# EAGLE design pcb_univ_3-6-0-x-rev5 (EAGLE 7.2.0)
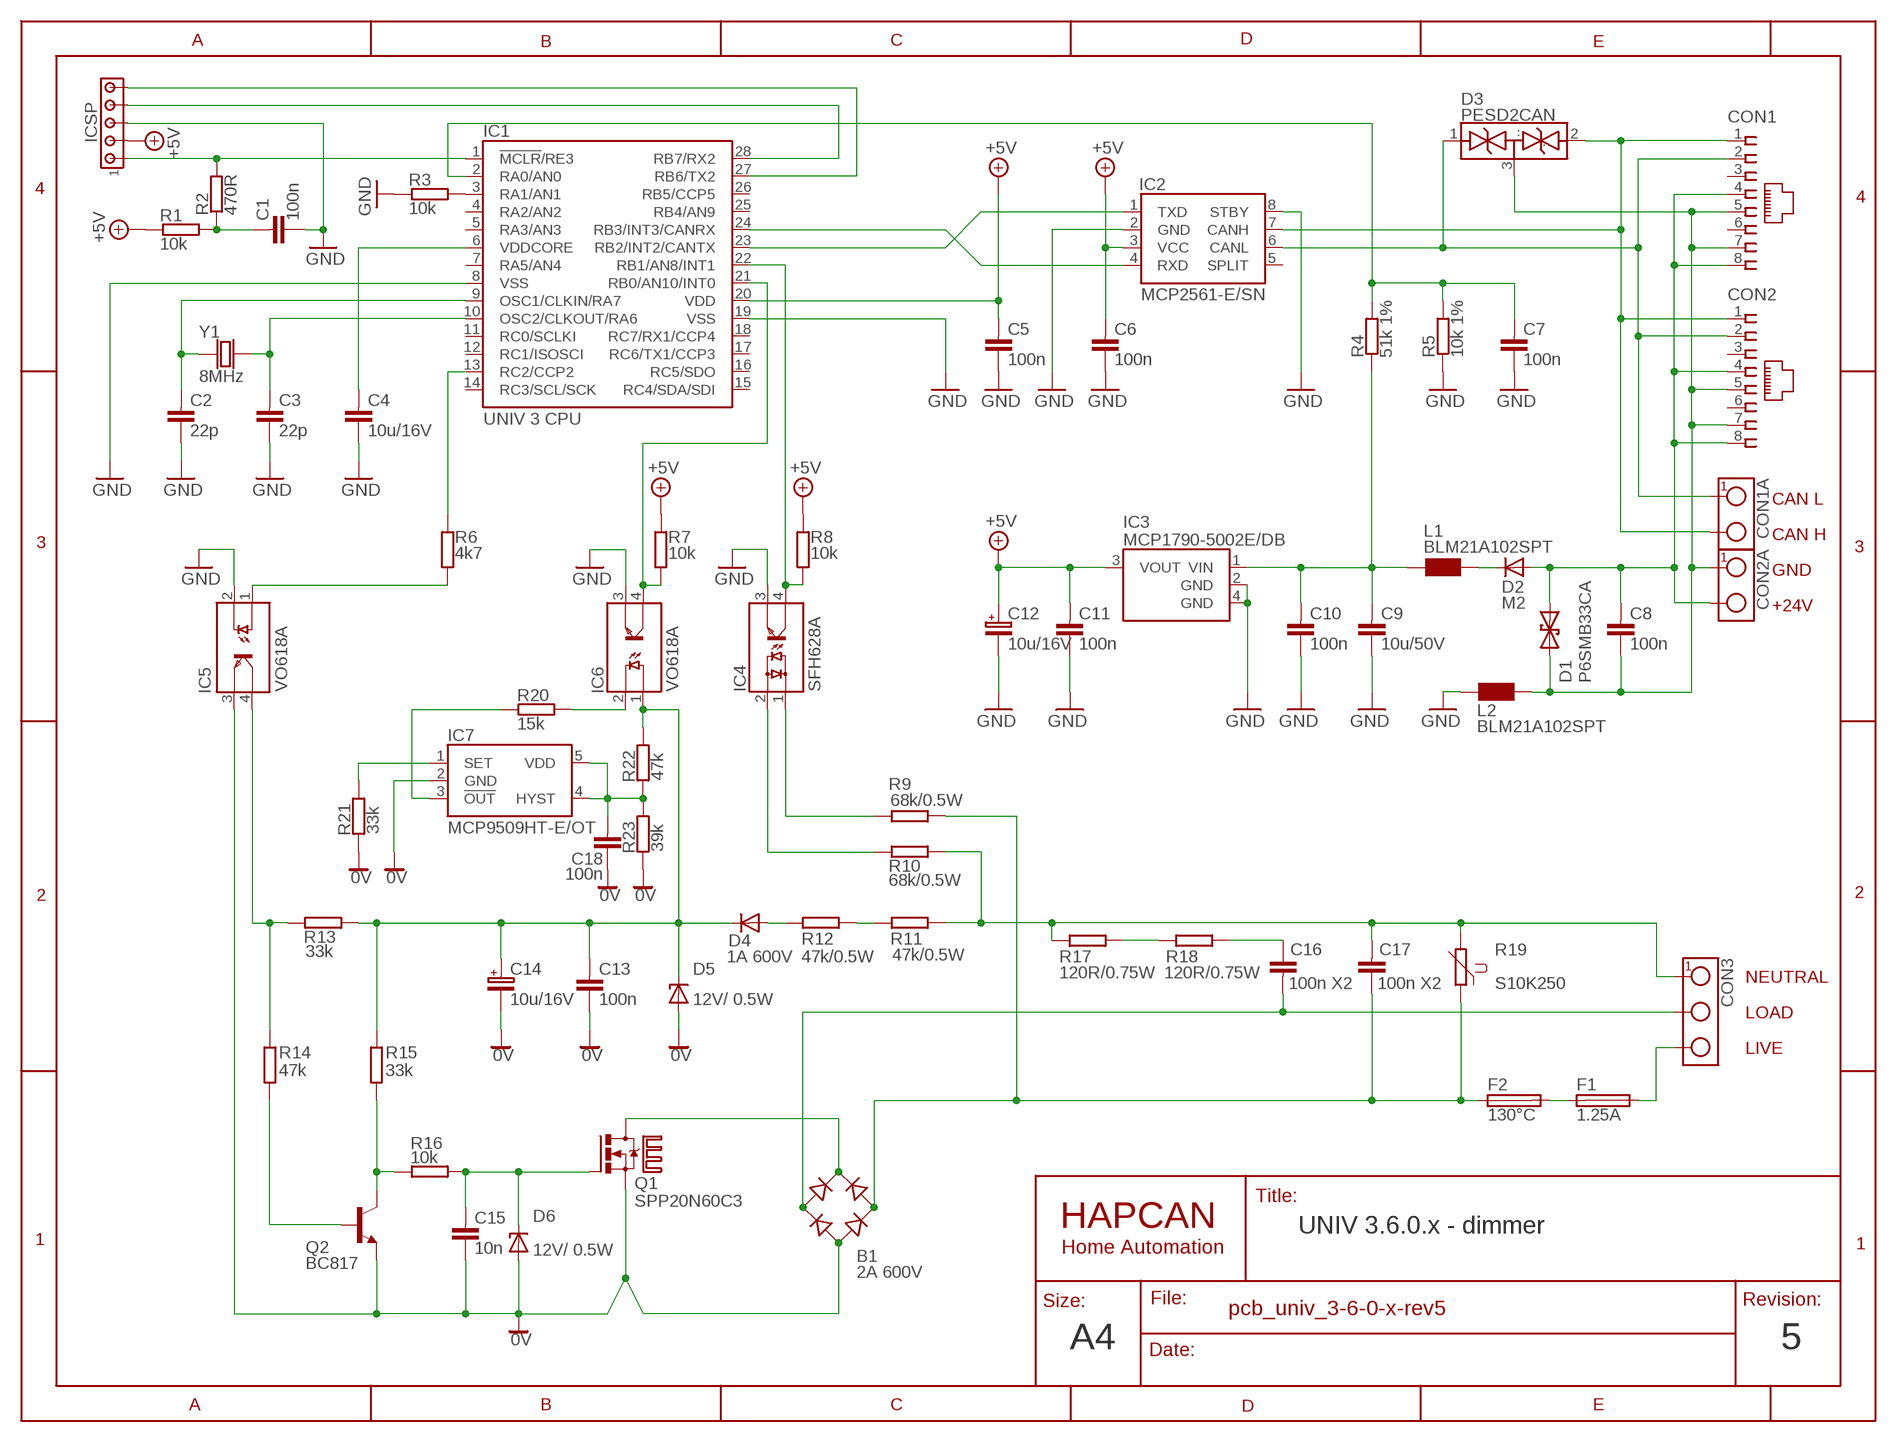
[diagram p0: schematic, sheet 1]

## Parts
B1  2A 600V  DIODE_BRIDGE-5.0  [RECTIFIER_KBP]
C1  100n  CAPACITOR0805  [0805]
C2  22p  CAPACITOR0805  [0805]
C3  22p  CAPACITOR0805  [0805]
C4  10u/16V  CAPACITOR0805  [0805]
C5  100n  CAPACITOR0805  [0805]
C6  100n  CAPACITOR0805  [0805]
C7  100n  CAPACITOR0805  [0805]
C8  100n  CAPACITOR0805  [0805]
C9  10u/50V  CAPACITOR1210  [1210]
C10  100n  CAPACITOR0805  [0805]
C11  100n  CAPACITOR0805  [0805]
C12  10u/16V  CAPACITOR-POLARIZED-SMC_B  [SMC_B]
C13  100n  CAPACITOR0805  [0805]
C14  10u/16V  CAPACITOR-POLARIZED-SMC_B  [SMC_B]
C15  10n  CAPACITOR0805  [0805]
C16  100n X2  CAPACITOR15X5  [CAP-15X5]
C17  100n X2  CAPACITOR15X5  [CAP-15X5]
C18  100n  CAPACITOR0805  [0805]
CON1  RJ45-SOCKET  [RJ45-PCB-SOCKET]
CON1A  TERMINAL-2  TERMINAL-2-5X10,5MM  [ARK2-5X10,5MM]
CON2  RJ45-SOCKET  [RJ45-PCB-SOCKET]
CON2A  TERMINAL-2  TERMINAL-2-5X10,5MM  [ARK2-5X10,5MM]
CON3  TERMINAL-3  TERMINAL-3-5X10.5MM  [ARK3-5X10.5MM]
D1  P6SMB33CA  DIODE_TRANSIL2  [DO-214_TRANSIL2]
D2  M2  DIODE_DO-214  [DO-214]
D3  PESD2CAN  PESD2CANSOT-23  [SOT-23]
D4  1A 600V  DIODE_MELF  [DO-213]
D5  12V/ 0.5W  DIODE_ZENER_SOD-80  [SOD-80]
D6  12V/ 0.5W  DIODE_ZENER_SOD-80  [SOD-80]
F1  1.25A  FUSE_V  [FUSE-HOLDER-V]
F2  130°C  FUSE  [FUSE-7.5]
IC1  UNIV 3 CPU  UNIV3CPU-I/SO  [UNIV3CPU]
IC2  MCP2561-E/SN  [SO-08]
IC3  MCP1790-5002E/DB  MCP1790  [SOT-223]
IC4  SFH628A  COUPLER-1CH-AC_WIDE  [DIL-04W]
IC5  VO618A  COUPLER-1CH_04W  [DIL-04W]
IC6  VO618A  COUPLER-1CH_04W  [DIL-04W]
IC7  MCP9509HT-E/OT  MCP9509  [SOT-23-5]
ICSP  HEADER5  [SIP-5]
L1  BLM21A102SPT  CHOKE0805  [0805]
L2  BLM21A102SPT  CHOKE0805  [0805]
Q1  SPP20N60C3  TRANSISTOR_MOSFET_N_TO220V-3  [TO220V-3]
Q2  BC817  TRANSISTOR_NPN  [SOT-23]
R1  10k  RESISTOR0805  [0805]
R2  470R  RESISTOR0805  [0805]
R3  10k  RESISTOR0805  [0805]
R4  51k 1%  RESISTOR0805  [0805]
R5  10k 1%  RESISTOR0805  [0805]
R6  4k7  RESISTOR0805  [0805]
R7  10k  RESISTOR0805  [0805]
R8  10k  RESISTOR0805  [0805]
R9  68k/0.5W  RESISTOR2010  [2010]
R10  68k/0.5W  RESISTOR2010  [2010]
R11  47k/0.5W  RESISTOR2010  [2010]
R12  47k/0.5W  RESISTOR2010  [2010]
R13  33k  RESISTOR0805  [0805]
R14  47k  RESISTOR0805  [0805]
R15  33k  RESISTOR0805  [0805]
R16  10k  RESISTOR0805  [0805]
R17  120R/0.75W  RESISTOR2010  [2010]
R18  120R/0.75W  RESISTOR2010  [2010]
R19  S10K250  VARISTOR7.5MM-2  [VARISTOR3]
R20  15k  RESISTOR0805  [0805]
R21  33k  RESISTOR0805  [0805]
R22  47k  RESISTOR0805  [0805]
R23  39k  RESISTOR0805  [0805]
U$1  HEATSINK_HS003  [HEATSINK_HS-003]
Y1  8MHz  CRYSTAL-HC49V  [CRYSTAL-HC49V]

## Nets
0V: B1.- C13.2 C14.- C15.2 C18.2 D5.A D6.A IC5.3(E) IC7.2(GND) Q1.3(S) Q2.2(E) R21.2 R23.2
+5V: C5.1 C6.1 C11.1 C12.+ IC1.20(VDD) IC2.3(VCC) IC3.3(VOUT) ICSP.2 R1.1 R7.2 R8.2
GND: C1.2 C2.2 C3.2 C4.2 C5.2 C6.2 C7.2 C9.2 C10.2 C11.2 C12.- IC1.8(VSS) IC1.19(VSS) IC2.2(GND) IC2.8(STBY) IC3.2(GND) IC3.4(GND) IC4.3(E1) IC5.2(K) IC6.3(E) ICSP.3 L2.1 R3.1 R5.1
N$1: C13.1 C14.+ D4.C D5.C IC6.1(A) R13.2 R15.1 R22.2
N$2: IC1.24(RB3/INT3/CANRX) IC2.4(RXD)
N$3: IC1.23(RB2/INT2/CANTX) IC2.1(TXD)
N$4: CON1.1 CON1A.2 CON2.1 D3.2(..) IC2.7(CANH)
N$5: IC4.2(A2) R10.1
N$6: B1.+ Q1.2(D)
N$7: C1.1 R1.2 R2.1
N$8: IC1.1(!MCLR!/RE3) ICSP.1 R2.2
N$9: C8.1 CON1.4 CON1.8 CON2.4 CON2.8 CON2A.2 D1.C D2.A
N$10: IC1.28(RB7/RX2) ICSP.4
N$11: Q2.3(C) R15.2 R16.2
N$12: IC1.3(RA1/AN1) R3.2
N$13: B1.AC2 C17.2 F2.1 R9.2 R19.1
N$14: IC1.27(RB6/TX2) ICSP.5
N$15: C3.1 IC1.10(OSC2/CLKOUT/RA6) Y1.2
N$16: C7.1 IC1.2(RA0/AN0) R4.2 R5.2
N$17: C9.1 C10.1 IC3.1(VIN) L1.1 R4.1
N$18: C15.1 D6.C Q1.1(G) R16.1
N$19: IC1.13(RC2/CCP2) R6.1
N$20: B1.AC1 C16.1 CON3.2
N$21: R11.2 R12.1
N$22: CON3.3 F1.1
N$23: IC4.1(A1) R9.1
N$24: F1.2 F2.2
N$25: D4.A R12.2
N$26: R17.1 R18.2
N$27: CON1.2 CON1A.1 CON2.2 D3.1(.) IC2.6(CANL)
N$28: C17.1 CON3.1 R10.2 R11.1 R17.2 R19.2
N$29: C16.2 R18.1
N$30: IC5.4(C) R13.1 R14.1
N$31: Q2.1(B) R14.2
N$33: C8.2 CON1.5 CON1.7 CON2.5 CON2.7 CON2A.1 D1.A D3.3(...) L2.2
N$34: IC1.21(RB0/AN10/INT0) IC6.4(C) R7.1
N$35: IC7.3(!OUT) R20.2
N$36: IC7.1(SET) R21.1
N$37: IC1.22(RB1/AN8/INT1) IC4.4(C1) R8.1
N$38: IC5.1(A) R6.2
N$39: C18.1 IC7.4(HYST) IC7.5(VDD) R22.1 R23.1
N$40: C2.1 IC1.9(OSC1/CLKIN/RA7) Y1.1
N$41: IC6.2(K) R20.1
N$56: C4.1 IC1.6(VDDCORE)
N$67: D2.C L1.2
Unconnected: CON1.3 CON1.6 CON2.3 CON2.6 IC1.4(RA2/AN2) IC1.5(RA3/AN3) IC1.7(RA5/AN4) IC1.11(RC0/SCLKI) IC1.12(RC1/ISOSCI) IC1.14(RC3/SCL/SCK) IC1.15(RC4/SDA/SDI) IC1.16(RC5/SDO) IC1.17(RC6/TX1/CCP3) IC1.18(RC7/RX1/CCP4) IC1.25(RB4/AN9) IC1.26(RB5/CCP5) IC2.5(SPLIT)

## Notes on the sheet
- CAN L
- CAN H
- GND
- +24V
- NEUTRAL
- LOAD
- LIVE
- UNIV 3.6.0.x - dimmer
- A4 | 5

## Library data of the parts
B1 = HAPCAN_devices - UNIV3:DIODE_BRIDGE: HAPCAN Single Phase Bridge Rectifier
C1-C11 C13 C15-C18 = HAPCAN_devices - UNIV3:CAPACITOR: HAPCAN Capacitor
C12 C14 = HAPCAN_devices - UNIV3:CAPACITOR-POLARIZED: HAPCAN Polarazied Capacitor
CON1 CON2 = HAPCAN_devices - UNIV3:RJ45-SOCKET: HAPCAN RJ45 socket
CON1A CON2A = HAPCAN_devices - UNIV3:TERMINAL-2: HAPCAN Terminal Block - 2 way
CON3 = HAPCAN_devices - UNIV3:TERMINAL-3: HAPCAN Terminal Block - 3 way
D1 = HAPCAN_devices - UNIV3:DIODE_TRANSIL2: HAPCAN Bidirectional transil diode
D2 D4 = HAPCAN_devices - UNIV3:DIODE: HAPCAN Rectifier Diode
D3 = HAPCAN_devices - UNIV3:PESD2CAN: CAN bus ESD protection diode
D5 D6 = HAPCAN_devices - UNIV3:DIODE_ZENER: HAPCAN ZENER DIODE
F1 F2 = HAPCAN_devices - UNIV3:FUSE: HAPCAN fuse
IC1 = HAPCAN_devices - UNIV3:UNIV3CPU: HAPCAN Microcontroller UNIV 3 CPU
IC2 = HAPCAN_devices - UNIV3:MCP2561: HAPCAN CAN Tranceiver
IC3 = HAPCAN_devices - UNIV3:MCP1790: 70 mA, High Voltage Regulator
IC4 = HAPCAN_devices - UNIV3:COUPLER-1CH-AC: COUPLER-1CH-AC
IC5 IC6 = HAPCAN_devices - UNIV3:COUPLER-1CH: COUPLER-1CH
IC7 = HAPCAN_devices - UNIV3:MCP9509: Resistor-Programmable Temperature Switch
ICSP = HAPCAN_devices - UNIV3:HEADER5: HAPCAN Header 5
L1 L2 = HAPCAN_devices - UNIV3:CHOKE: Choke
Q1 = HAPCAN_devices - UNIV3:TRANSISTOR_MOSFET_N: HAPCAN N-MOSFET
Q2 = HAPCAN_devices - UNIV3:TRANSISTOR_NPN: HAPCAN NPN Transistor
R1-R18 R20-R23 = HAPCAN_devices - UNIV3:RESISTOR: HAPCAN Resistor
R19 = HAPCAN_devices - UNIV3:VARISTOR: HAPCAN Varistor
U$1 = HAPCAN_devices - UNIV3:HEATSINK: HAPCAN Heatsink
Y1 = HAPCAN_devices - UNIV3:CRYSTAL: HAPCAN Crystal

## Board
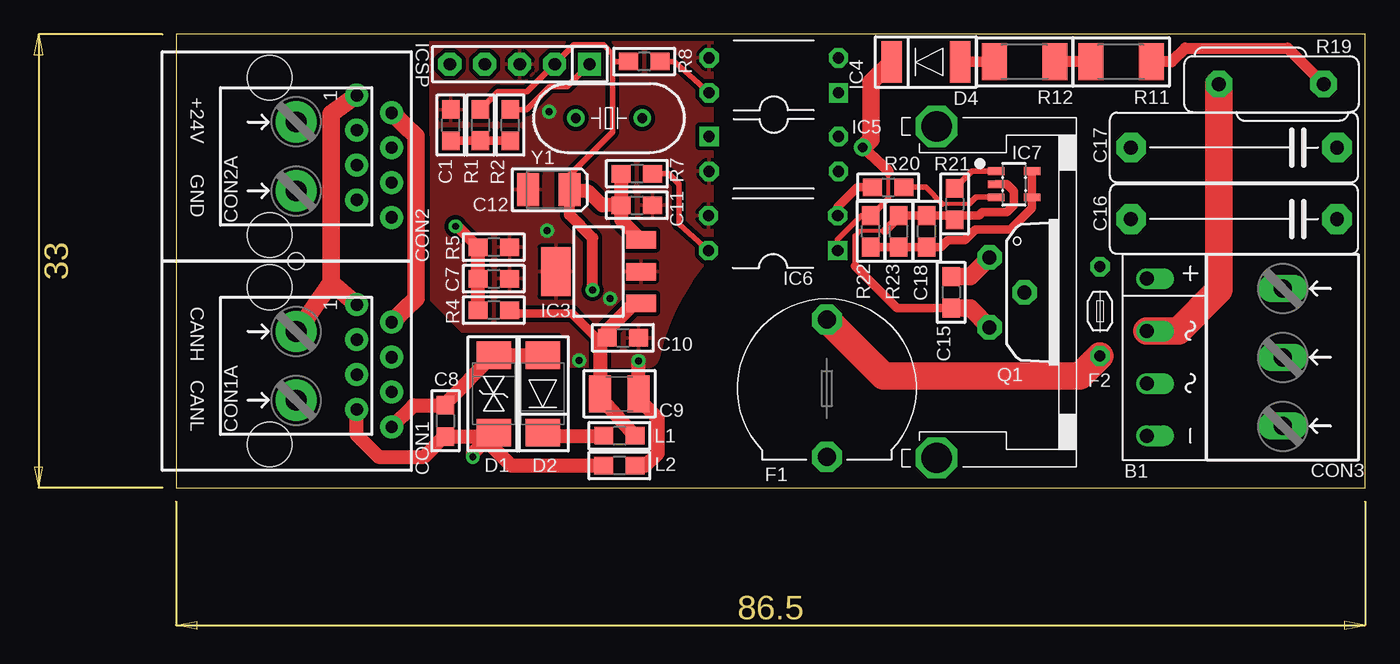
[diagram p1: board, top side]
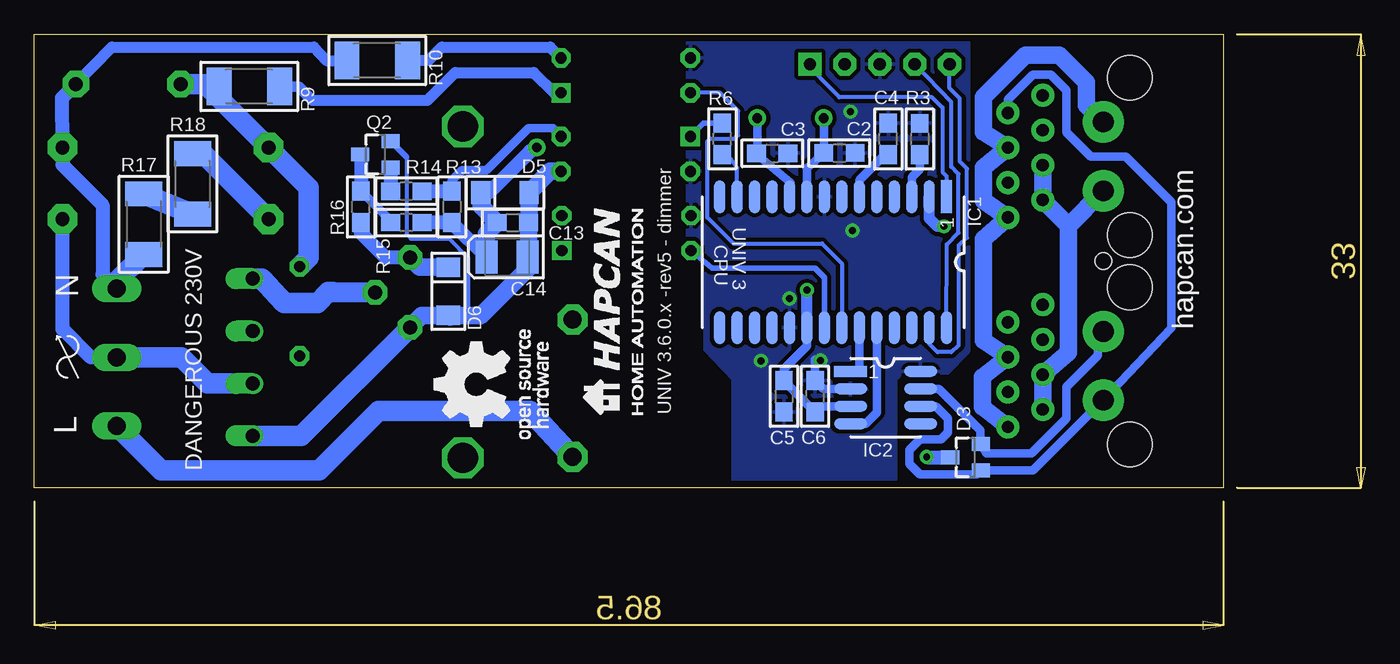
[diagram p2: board, bottom side, seen from below]

Size 86.5 x 33 mm. Coordinates in mm from the lower left corner, seen from the top.
Outline: 0,33 0,0 86.5,0 86.5,33 0,33
Copper layers (1*16): Top 0.035mm / dielectric 1.5mm / Bottom 0.035mm
Design rules "HAPCAN-Drc *": minimum track width 10mil, minimum drill 0.5mm, track to track 12mil, track to pad 12mil, pad to pad 12mil, via to via 12mil, smd to smd 10mil, copper to edge 20mil, drill to drill 8mil, minimum pad ring 10mil, minimum via ring 10mil, stop-mask expansion 4mil, vias tented up to drill 0mil, thermal gap 10mil
Holes 1.2 mm at 8.74,16.5

### Footprints (pad centres in the part's own frame; a part is rotated, then mirrored left to right if it is on the bottom)
RECTIFIER_KBP = drill 1.016 offset: + 5.715,1.27; - -5.715,1.27; AC1 -1.905,1.27; AC2 1.905,1.27
0805 = smd 1.372 x 1.27: 1 -1.143,0; 2 1.143,0
1210 = smd 1.6 x 2.7: 1 -1.4,0; 2 1.4,0
SMC_B = smd 1.6 x 2.4: + -1.5,0; - 1.5,0
CAP-15X5 = drill 1.016 pad 2.159 octagon: 1 -7.493,0; 2 7.493,0
RJ45-PCB-SOCKET = drill 0.9 pad 1.676: 1 -4.445,6.35; 2 -3.175,8.89; 3 -1.905,6.35; 4 -0.635,8.89; 5 0.635,6.35; 6 1.905,8.89; 7 3.175,6.35; 8 4.445,8.89 | hole 3.251: -5.715,0; 5.715,0
ARK2-5X10,5MM = drill 1.5 pad 3: 1 -2.5,0; 2 2.5,0
ARK3-5X10.5MM = drill 1.3 pad 2 long: 1 -5,0; 2 0,0; 3 5,0
DO-214_TRANSIL2 = smd 2 x 2.5: A 2.82,0; C -2.82,0
DO-214 = smd 2 x 2.5: A 2.82,0; C -2.82,0
SOT-23 = smd 1.016 x 1.321: 1 -0.965,-1.118; 2 0.965,-1.118; 3 0,1.118
DO-213 = smd 1.5 x 3: A 2.5,0; C -2.5,0
SOD-80 = smd 1.4 x 1.7: A 1.75,0; C -1.75,0
FUSE-HOLDER-V = drill 1.3 pad 2.184 octagon: 1 -5,0; 2 5,0
FUSE-7.5 = drill 0.813 pad 1.422 octagon: 1 -3.25,0; 2 3.25,0
UNIV3CPU = smd 2.4 x 0.8: 1 -4.763,8.255; 2 -4.763,6.985; 3 -4.763,5.715; 4 -4.763,4.445; 5 -4.763,3.175; 6 -4.763,1.905; 7 -4.763,0.635; 8 -4.763,-0.635; 9 -4.763,-1.905; 10 -4.763,-3.175; 11 -4.763,-4.445; 12 -4.763,-5.715; 13 -4.763,-6.985; 14 -4.763,-8.255; 15 4.763,-8.255; 16 4.763,-6.985; 17 4.763,-5.715; 18 4.763,-4.445; 19 4.763,-3.175; 20 4.763,-1.905; 21 4.763,-0.635; 22 4.763,0.635; 23 4.763,1.905; 24 4.763,3.175; 25 4.763,4.445; 26 4.763,5.715; 27 4.763,6.985; 28 4.763,8.255
SO-08 = smd 2.4 x 0.8: 1 -2.54,1.905; 2 -2.54,0.635; 3 -2.54,-0.635; 4 -2.54,-1.905; 5 2.54,-1.905; 6 2.54,-0.635; 7 2.54,0.635; 8 2.54,1.905
SOT-223 = smd 1.27 x 2.159: 1 -2.311,-3.099; 2 0,-3.099; 3 2.311,-3.099 | smd 3.556 x 2.159: 4 0,3.099
DIL-04W = drill 0.813 pad 1.4 square: 1 -4.7,1.27 | drill 0.813 pad 1.4 octagon: 2 -4.7,-1.27; 3 4.7,-1.27; 4 4.7,1.27
SOT-23-5 = smd 0.55 x 1.2: 1 -0.95,-1.3; 2 0,-1.3; 3 0.95,-1.3; 4 0.95,1.3; 5 -0.95,1.3
SIP-5 = drill 0.9 pad 1.676 square: 1 -5.08,0 | drill 0.9 pad 1.676 octagon: 2 -2.54,0; 3 0,0; 4 2.54,0; 5 5.08,0
TO220V-3 = drill 1.016 pad 1.778 octagon: 1 -2.54,-2.54; 2 0,0; 3 2.54,-2.54
2010 = smd 1.8 x 2.7: 1 -2.2,0; 2 2.2,0
VARISTOR3 = drill 1.016 pad 1.93 octagon: 1 0,-3.81; 2 0,3.81
HEATSINK_HS-003 = drill 2.2 pad 3 octagon: P$1 -12.065,10.16; P$2 12.065,10.16
CRYSTAL-HC49V = drill 0.7 pad 1.27: 1 -2.413,0; 2 2.413,0

### Placement (x,y rotation side)
B1  71.89,9.5 90 top
C1  19.99,26.39 90 top
C2  27.94,24.36 0 bottom
C3  32.83,24.35 0 bottom
C4  24.38,25.39 90 bottom
C5  31.97,6.66 270 bottom
C6  29.72,6.66 90 bottom
C7  23.11,15.22 0 top
C8  19.61,4.87 270 top
C9  32.26,6.84 0 top
C10  32.51,10.92 0 top
C11  33.53,20.56 0 top
C12  27.11,21.69 180 top
C13  51.69,19.3 0 bottom
C14  52.12,16.79 0 bottom
C15  56.39,14.22 270 top
C16  76.96,19.56 180 top
C17  76.96,24.77 180 top
C18  54.61,18.67 90 top
CON1  6.8,8.88 270 top
CON1A  8.74,8.88 90 top
CON2  6.8,24.12 270 top
CON2A  8.74,24.12 90 top
CON3  80.5,9.5 270 top
D1  23.11,6.84 270 top
D2  26.67,6.84 90 top
D3  18.77,2.23 90 bottom
D4  54.55,30.99 0 top
D5  52.27,21.49 0 bottom
D6  56.39,14.3 270 bottom
F1  47.34,7.25 90 top
F2  67.21,12.85 270 top
IC1  28.4,16.42 270 bottom
IC2  24.58,6.57 0 bottom
IC3  30.73,15.73 90 top
IC4  43.48,30.02 180 top
IC5  43.48,24.3 0 top
IC6  43.43,18.54 180 top
IC7  60.96,22.1 270 top
ICSP  25,30.83 180 top
L1  32.26,3.79 180 top
L2  32.26,1.62 180 top
Q1  61.72,14.22 270 top
Q2  61.7,24.27 90 bottom
R1  22.15,26.4 270 top
R2  24.31,26.39 90 top
R3  22.1,25.38 270 bottom
R4  23.11,12.93 180 top
R5  23.11,17.51 180 top
R6  36.45,25.4 90 bottom
R7  33.53,22.86 180 top
R8  34.06,31.01 180 top
R9  70.87,29.21 180 bottom
R10  61.56,31.1 180 bottom
R11  68.75,31 180 top
R12  61.73,31 180 top
R13  56.13,20.45 270 bottom
R14  59.44,21.59 180 bottom
R15  59.44,19.3 180 bottom
R16  62.74,20.45 90 bottom
R17  78.55,19.19 270 bottom
R18  74.99,22.12 270 bottom
R19  79.68,29.38 270 top
R20  51.82,21.87 0 top
R21  56.64,20.65 270 top
R22  50.55,18.67 90 top
R23  52.58,18.67 90 top
U$1  65.49,14.24 90 top
Y1  31.5,26.9 0 top

### Tracks (layer width: path | path; a pad name or v marks a point on that pad's centre or on a via)
0V
  Top 0.305: 51.56,18.67 49.71,18.67
  Top 0.381: 49.71,18.67 49.4,18.34
  Top 0.406: R21.2 56.77,19.56 | 49.4,18.34 49.4,16.13
  Top 0.61: 49.4,16.13 52.45,13.08 C15.2 | 51.56,18.67 52.58,19.68 R23.2 C18.2 56.34,19.81 R21.2 56.84,19.51 57.15,19.81 58.42,19.81 58.67,20.07 60.45,20.07 60.96,20.57 60.96,21.59 60.45,22.1 IC7.2
  Top 1.27: C15.2 57.78,13.08 Q1.3
  Bottom 0.305: 59.44,24.06 59.44,18.47 59.11,18.14 56.34,18.14 54.94,16.74 54.94,12.55
  Bottom 0.406: Q2.2 59.44,24.06
  Bottom 1.27: IC5.3 48.98,23.03 D5.A 50.52,19.33 C13.2 50.55,16.86 C14.- 50.62,15.93 54,12.55 54.94,12.55 D6.A | 56.26,12.45 D6.A | Q1.3 58.32,12.55 D6.A
  Bottom 1.5: B1.- 67.08,3.79 Q1.3
+5V  (via drill 0.5 pad 1)
  Top 0.406: C12.+ 28.61,22.75 31.75,25.89 31.75,31.01 | 31.75,31.01 31.75,31.57 31.08,32.24 28.95,32.24 ICSP.2 25.55,28.83 23.44,28.83 R1.1 | R8.2 31.75,31.01
  Top 0.813: C12.+ 28.61,19.88 30.3,18.19 v30.3,14.4
  Top 1.016: C11.1 32.38,19.49 IC3.3 | C11.1 31,20.56 29.97,21.59 28.72,21.59 C12.+ | R7.2 C11.1
  Bottom 0.61: IC2.3 29.3,5.93 C6.1 31.98,7.77 C5.1 31.98,8.64 30.3,10.32 IC1.20
  Bottom 0.813: IC1.20 30.29,14.45 v30.3,14.4
GND  (via drill 0.5 pad 1)
  Top 1.016: L2.1 34.15,1.62 35.05,2.52 35.05,5.06 33.66,6.45 C9.2 33.66,6.49 v33.66,9.25
  Bottom 0.61: IC2.2 29.12,7.2 C6.2 29.72,9.33 v29.31,9.27
  other vias: 31.57,13.77 27,18.72 27.13,27.38
  pour Top (isolate 0.305): 38.99,33 38.99,17.02 arc30 35.05,9.4 arc-90 34.04,8.86 28.7,8.86 28.7,10.65 27.94,11.41 20.83,11.41 18.54,13.7 18.54,33
  pour Bottom (isolate 0.305): 38.99,33 38.99,17.27 37.72,15.62 37.72,10.03 35.69,7.87 35.69,0 23.88,0 23.88,7.85 23.37,8.36 20.07,8.36 18.54,9.89 18.54,33
N$1  (via drill 0.7 pad 1.27)
  Top 0.305: 51.82,21.03 51.82,23.04 | 50.55,19.79 R22.2 | IC6.1
  Top 0.381: 49.86,19.81 48.13,18.09
  Top 0.406: 48.13,18.09 IC6.1 | 49.86,19.81 R22.2 | 50.55,19.79 51.82,21.03
  Top 0.813: 51.82,23.04 v49.96,24.77
  Top 1.27: D4.C 50.55,29.51 50.55,25.35 v49.96,24.77
  Bottom 1: C14.+ R13.2 R15.1
  Bottom 1.016: D5.C 53.44,21.49 50.42,24.51 v49.96,24.77
  Bottom 1.27: C14.+ 53.62,18.52 C13.1 54.02,20.5 D5.C
N$2
  Bottom 0.61: IC1.24 25.22,5.51 25.21,5.5 26.05,4.66 IC2.4
N$3
  Bottom 0.61: IC1.23 26.49,8.47 IC2.1
N$4
  Top 1.016: CON1A.2 8.8,11.38
  Top 1.27: 11.3,14.93 CON1.1 | 11.3,14.93 11.3,27.23 CON2.1 | 8.8,11.38 11.3,14.93
  Bottom 0.61: CON1A.2 9.14,11.29 9.14,9.63 11.43,7.35 11.43,5.06 13.97,2.52 17.27,2.52 D3.2 17.67,4.19 20.68,7.2 IC2.7
N$5
  Bottom 0.813: IC4.2 48.98,32.08 56.87,32.08 57.85,31.1 R10.1
N$6
  Bottom 1.5: B1.+ 69.95,15.21 68.33,13.46 65.91,13.46 65.14,14.24 64.77,14.24 Q1.2
N$7
  Top 0.61: C1.1 20.25,25.25 R1.2 22.41,25.25 R2.1
N$8
  Top 0.406: ICSP.1 28.46,29.21 27.18,29.21 25.5,27.54 R2.2
  Bottom 0.305: ICSP.1 29.97,30.56 29.21,29.7 27.94,28.43 21.21,28.43 20.45,27.67 20.45,22.99 20.14,22.68 IC1.1
N$9
  Top 1.016: CON1.8 17.27,6.01 C8.1 19.61,6.15 D1.C D2.A
  Bottom 1.27: CON1.8 17.53,5.9 17.53,8.07 CON1.4 17.48,10.72 17.48,18.09 CON2.8 17.48,20.89 17.48,23.31 CON2.4 17.48,25.89 17.48,28.43 14.43,31.48 11.94,31.48 9.98,29.52 9.98,27.86 CON2A.2
N$10
  Bottom 0.305: IC1.28 20.13,17.72 19.28,18.57 19.28,22.84 19.81,23.37 19.81,28.05 ICSP.4
N$11
  Bottom 0.61: R15.2 60.58,19.43 R16.2
  Bottom 1: 62.74,24.22 R16.2
  Bottom 1.016: Q2.3 62.74,24.22
N$12
  Bottom 0.61: R3.2 22.1,23.19 22.68,22.61 IC1.3
N$13
  Top 2: B1.AC2 70.64,11.43 72.9,11.43 75.87,14.4 R19.1
  Bottom 1.016: 74.08,29.38 73.91,29.21 R9.2
  Bottom 1.5: F2.1 66.55,16.76 66.55,21.84 C17.2 74.08,29.38 R19.1
N$14
  Bottom 0.305: ICSP.5 19.92,29.07 19.18,28.32 19.18,23.75 18.66,23.21 18.66,18.21 19.25,17.65 19.25,10.39 19.81,9.89 20.81,9.89 21.41,10.49 IC1.27
N$15
  Bottom 0.61: Y1.2 33.91,24.55 C3.1 33.91,24.05 33.7,24.05 31.5,22.23 31.5,21.26 IC1.10
N$16  (via drill 0.5 pad 1)
  Top 0.813: R5.2 20.37,19.11 v20.34,19.03
  Top 1.016: R5.2 C7.1 R4.2
  Bottom 0.813: IC1.2 21.4,19.6 20.83,19.03 v20.34,19.03
N$17
  Top 0.61: 30.86,10.66 28.82,12.7 24.49,12.7 arc-90 R4.1
  Top 0.965: 30.99,6.43 L1.1
  Top 1.016: 30.99,6.43 30.99,6.84 C9.1 30.86,10.66 C10.1 31.37,11.46 33.33,13.42 IC3.1
N$18
  Top 1.27: C15.1 57.78,15.37 Q1.1
  Bottom 1: Q1.1 60.96,16.76 62.74,18.54 R16.1
  Bottom 1.27: D6.C 58.47,16.05 Q1.1
N$19
  Bottom 0.305: IC1.13 35.38,23.29 36.3,24.66 R6.1
N$20
  Bottom 1: CON3.2 82.4,9.5 84.45,11.56 C16.1
  Bottom 1.5: CON3.2 75.79,9.5 73.89,7.59 B1.AC1
N$21
  Top 0.813: R11.2 R12.1
N$22
  Bottom 1.5: F1.1 50.43,5.59 61.47,5.59 65.79,1.27 77.27,1.27 CON3.3
N$23
  Bottom 0.813: R9.1 67.31,29.21 66.29,28.19 57.91,28.19 55.88,30.23 50.17,30.23 48.69,28.75 IC4.1
N$24
  Top 2: F1.2 51.46,8.13 65.75,8.13 F2.2
N$25
  Top 0.813: R12.2 D4.A
N$26
  Bottom 1.5: R18.2 R17.1
N$27
  Top 1.27: CON2.2 17.48,25.59 17.48,13.77 CON1.2
  Bottom 0.61: CON2.2 15.69,28.23 13.87,30.05 12.55,30.05 11.43,28.94 11.43,25.89 9.65,24.11 7.11,24.11 3.81,20.81 3.81,11.63 CON1A.1 8.76,6.37 13.87,1.26 D3.1 17.95,1 22.1,1 22.86,1.76 22.86,2.77 22.1,3.54 20.57,3.54 20.07,4.04 20.07,5.06 20.94,5.93 IC2.6
N$28
  Top 0.813: R19.2 80.87,32 73.41,32 72.41,31 R11.1 71.13,31
  Bottom 0.813: R19.2 80.87,32.08 66.17,32.08 65.27,31.1 R10.2
  Bottom 1: R19.2 84.48,28.39 C17.1 84.45,23.5 81.53,20.57 81.53,15.53 CON3.1
  Bottom 1.5: R17.2 80.5,15.04 CON3.1
N$29
  Bottom 1.5: C16.2 74.23,24.32 R18.1
N$30
  Bottom 0.61: R13.1 56.13,22.35 55.37,23.11 53.59,23.11 50.55,26.16 48.77,26.16 IC5.4
  Bottom 1: R14.1 R13.1
N$31
  Bottom 1: 60.58,23.28 R14.2
  Bottom 1.016: Q2.1 60.58,23.28
N$33  (via drill 0.5 pad 1)
  Top 1.016: 22.82,3.73 C8.2 19.5,3.73 18.03,2.27 14.73,2.27 13.15,3.85 CON1.7 | L2.2 24.38,1.62 23,3 23,3.9 D1.A 22.82,3.73 | v21.59,2.26 21.59,2.49 22.82,3.73
  Bottom 1.016: D3.3 21.56,2.23 v21.59,2.26
  Bottom 1.27: CON2.5 CON2.7 11.3,19.1 11.3,19.05 | CON1.7 CON1.5 11.3,9.85 11.3,19.05 | CON2A.1 11.3,19.05
N$34
  Top 0.406: IC6.4 36.58,19.18 36.58,22.1 35.81,22.86 R7.1
  Bottom 0.406: IC1.21 29.03,15.32 29.72,16 37.21,16 IC6.4
N$35
  Top 0.305: 57.68,20.65 55.75,20.65
  Top 0.406: IC7.3 58.18,21.15 57.68,20.65 | 55.75,20.65 54.53,21.87 R20.2
N$36
  Top 0.406: IC7.1 57.9,23.05 R21.1
N$37
  Top 0.406: R8.1 36.26,31.01 IC4.4
  Bottom 0.305: IC1.22 27.76,16.33 29.21,17.78 35.64,17.78 37.54,19.66 37.54,25.22 37.34,25.4 35.56,25.4 35.31,25.65 35.31,27.43 36.62,28.75 IC4.4
N$38
  Bottom 0.406: R6.2 37.83,26.53 IC5.1
N$39
  Top 0.61: R22.1 R23.1 C18.1 55.63,17.53 56.13,18.03 57.4,18.03 58.17,18.8 60.71,18.8 62.26,20.35 IC7.4 IC7.5
N$40
  Bottom 0.61: Y1.1 C2.1 30.3,23.27 IC1.9
N$41
  Top 0.61: R20.1 49.55,21.87 48.13,20.45 IC6.2
N$56
  Bottom 0.61: C4.1 24.52,24.36 26.49,22.38 IC1.6
  Bottom 0.813: C4.1 24.14,24.36
N$67
  Top 1.016: D2.C 27.66,3.79 L1.2

### Text on the board
tPlace: +24V | GND | CANH | CANL
bPlace: hapcan.com | N | UNIV 3.6.0.x -rev5 - dimmer | L | DANGEROUS 230V